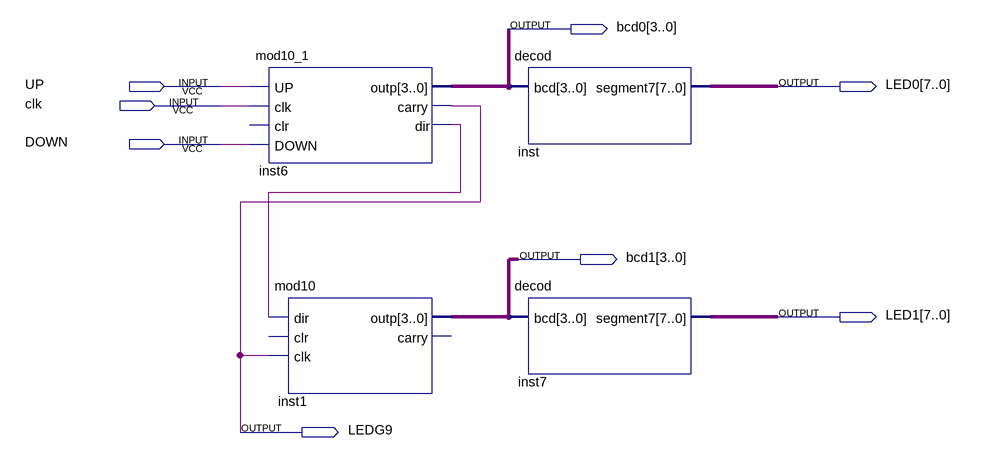
[diagram p0: schematic sheet]
// Quartus schematic cw3.bdf as structural Verilog: 4 symbols, 8 pins
module cw3 (
  input  UP,
  input  clk,
  input  DOWN,
  output [3:0] bcd0,
  output [7:0] LED0,
  output [3:0] bcd1,
  output [7:0] LED1,
  output LEDG9
);

  wire inst6_dir;

  mod10_1 inst6 (.UP(UP), .clk(clk), .DOWN(DOWN), .outp(bcd0), .carry(LEDG9), .dir(inst6_dir));  // open: clr
  mod10 inst1 (.dir(inst6_dir), .clk(LEDG9), .outp(bcd1));  // open: clr, carry
  decod inst (.bcd(bcd0), .segment7(LED0));
  decod inst7 (.bcd(bcd1), .segment7(LED1));
endmodule
